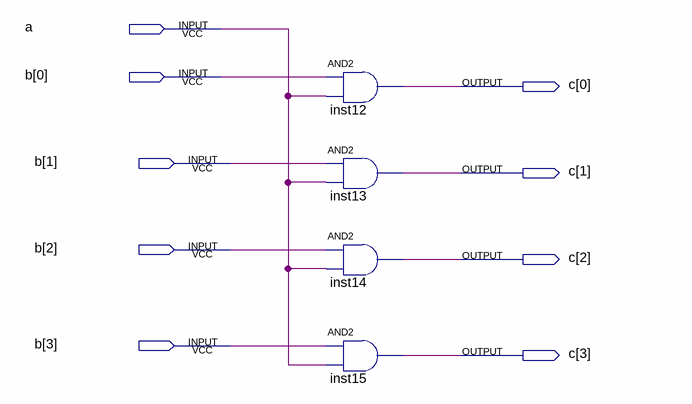
[diagram p0: schematic sheet]
// Quartus schematic 4_1_multiply.bdf as structural Verilog: 4 symbols, 9 pins
module \4_1_multiply  (
  input  a,
  input  [3:0] b,
  output [3:0] c
);

  and inst12 (c[0], b[0], a);
  and inst13 (c[1], b[1], a);
  and inst14 (c[2], b[2], a);
  and inst15 (c[3], b[3], a);
endmodule
